# EAGLE design sb7pads-7D (EAGLE 9.4.2)
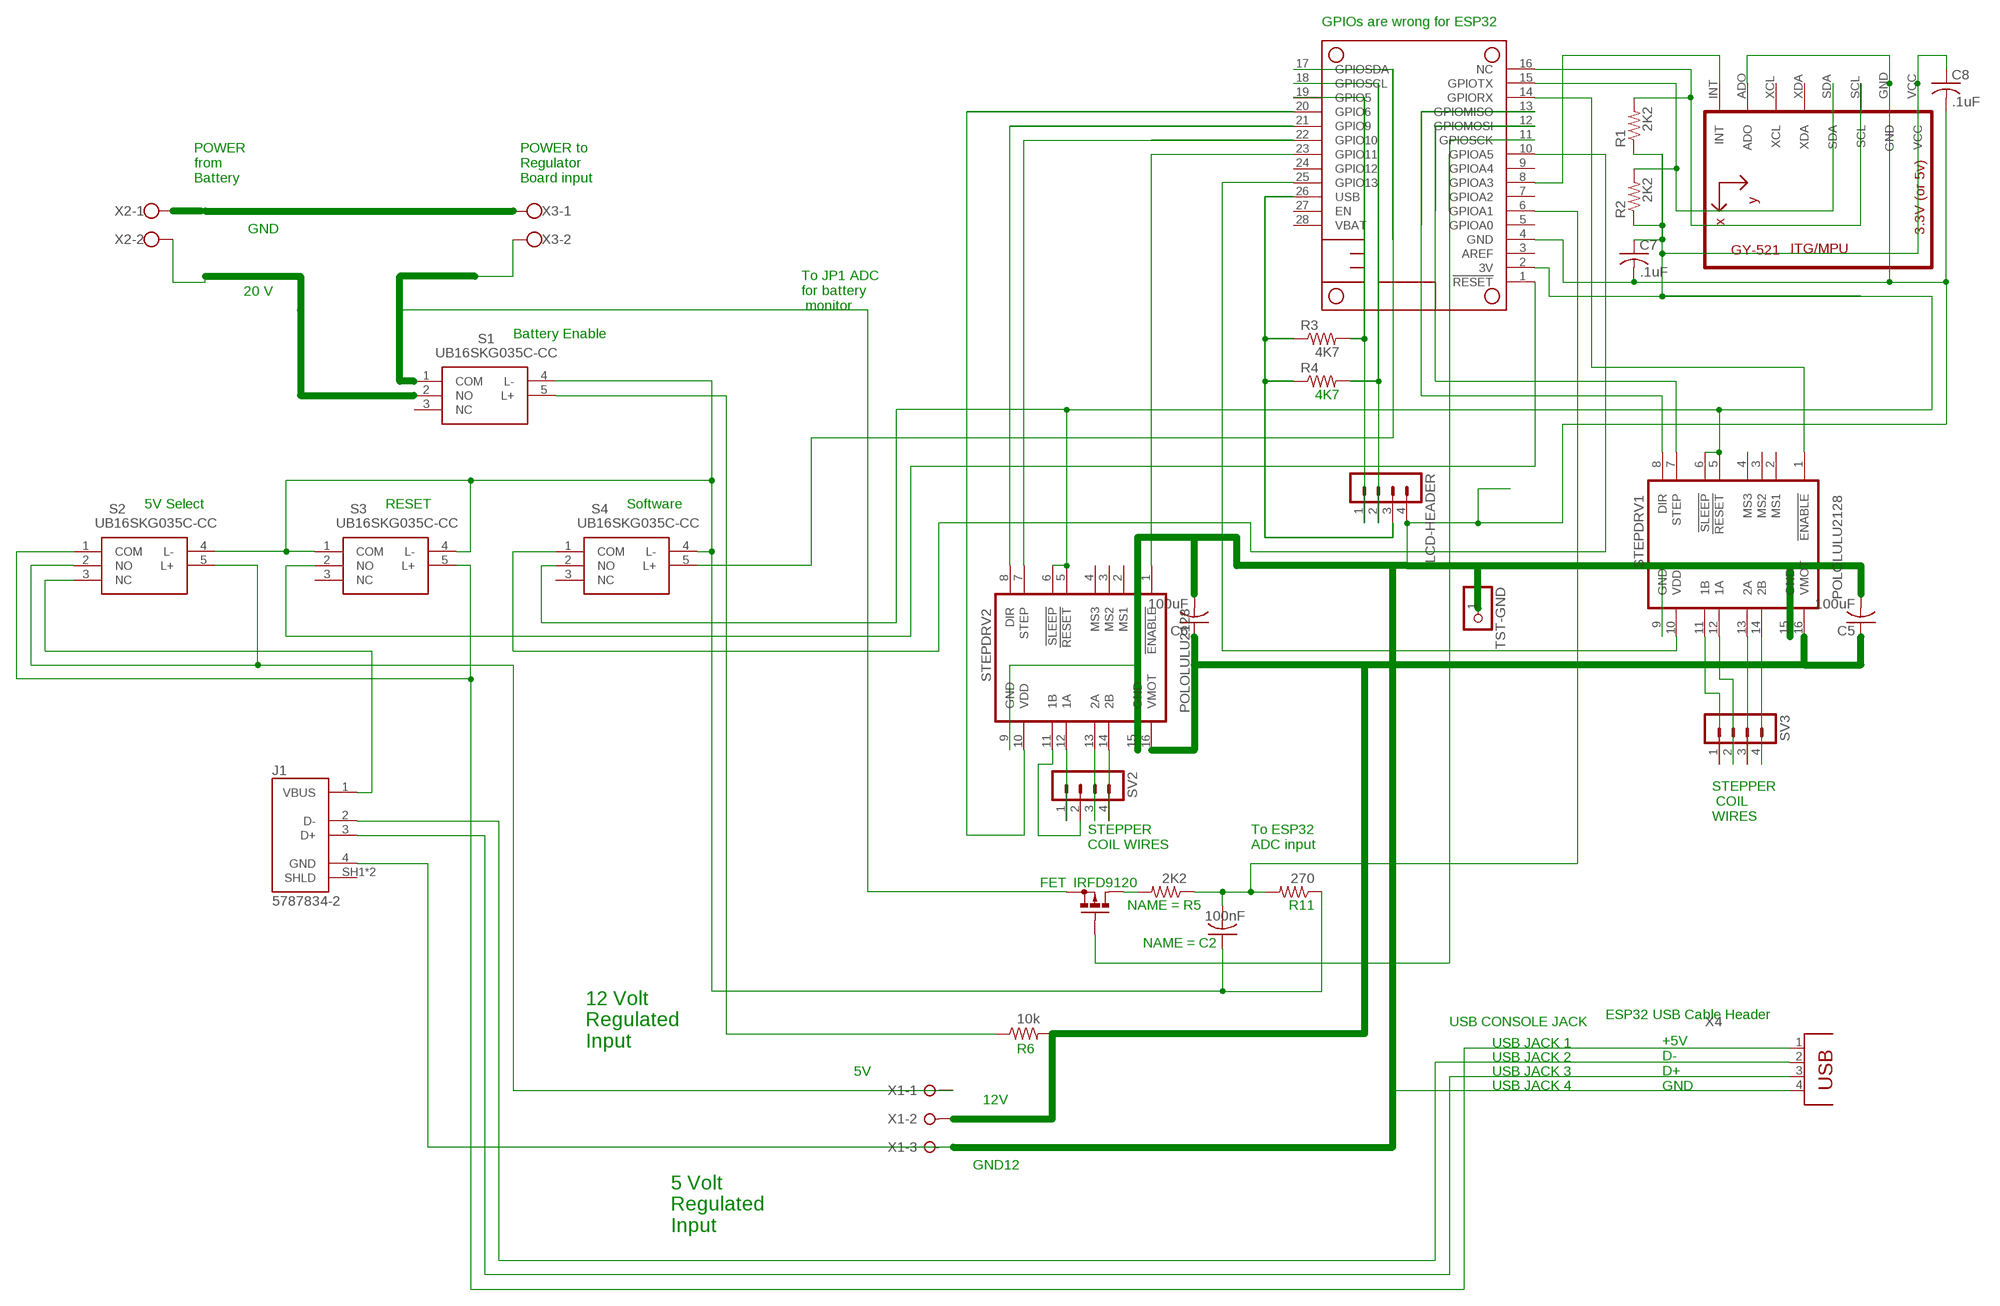
[diagram p0: schematic, sheet 1]

## Parts
C2  100nF  C-US050-025X075  [C050-025X075]
C5  100uF  C-US050-024X044  [C050-024X044]
C6  100uF  C-US050-024X044  [C050-024X044]
C7  .1uF  C-US050-024X044  [C050-024X044]
C8  .1uF  C-US050-024X044  [C050-024X044]
FET  IRFD9120  [C370-01]
J1  5787834-2  [TE_5787834-2]
LCD-HEADER  MA04-1  [MA04-1]
MS2  FEATHERWING_NOHOLES  [FEATHERWING_NOHOLES]
R1  2K2  R-US_0309/12  [0309/12]
R2  2K2  R-US_0309/12  [0309/12]
R3  4K7  R-US_0309/12  [0309/12]
R4  4K7  R-US_0309/12  [0309/12]
R5  2K2  R-US_0207/10  [0207/10]
R6  10k  R-US_0207/10  [0207/10]
R11  270  R-US_0207/10  [0207/10]
S1  UB16SKG035C-CC  [UB16SKG035CCC]
S2  UB16SKG035C-CC  [UB16SKG035CCC]
S3  UB16SKG035C-CC  [UB16SKG035CCC]
S4  UB16SKG035C-CC  [UB16SKG035CCC]
STEPDRV1  POLOLULU2128  [POLOLULU2128]
STEPDRV2  POLOLULU2128  [POLOLULU2128]
SV2  MA04-1  [MA04-1]
SV3  MA04-1  [MA04-1]
TST-GND  PINHD-1X1  [1X01]
U1  GY-521MPU6050  [GY-521]
X1  W237-3E  [W237-3E]
X2  W237-02P  [W237-132]
X3  W237-02P  [W237-132]
X4  PN87520  [PN87520]

## Nets
3V: C7.1 C8.1 MS2.2(3V) R1.1 R2.1 S4.2(NO) STEPDRV1.5(!RESET) STEPDRV1.6(!SLEEP) STEPDRV2.5(!RESET) STEPDRV2.6(!SLEEP) U1.VCC
N$1: MS2.25(GPIO13) STEPDRV1.10(VDD)
N$2: FET.G MS2.11(GPIOSCK)
N$3: S1.2(NO) X2.2
N$4: MS2.1(!RESET) S3.2(NO)
N$5: MS2.21(GPIO9) STEPDRV2.8(DIR)
N$6: FET.S S1.1(COM) X3.2
N$7: MS2.14(GPIORX) STEPDRV1.1(!ENABLE)
N$8: STEPDRV2.14(2B) SV2.4
N$9: STEPDRV2.12(1A) SV2.1
N$11: LCD-HEADER.1 MS2.19(GPIO5) R3.2
N$12: STEPDRV2.13(2A) SV2.3
N$13: STEPDRV2.11(1B) SV2.2
N$14: MS2.8(GPIOA3) U1.INT
N$15: MS2.12(GPIOMOSI) STEPDRV1.7(STEP)
N$16: STEPDRV1.14(2B) SV3.4
N$17: MS2.16(NC) R1.2 U1.SCL
N$18: STEPDRV1.13(2A) SV3.3
N$19: STEPDRV1.12(1A) SV3.2
N$20: STEPDRV1.11(1B) SV3.1
N$21: X2.1 X3.1
N$22: J1.2(D-) X4.2
N$23: J1.3(D+) X4.3
N$24: MS2.13(GPIOMISO) STEPDRV1.8(DIR)
N$25: MS2.15(GPIOTX) R2.2 U1.SDA
N$27: C5.2 C6.2 C7.2 C8.2 J1.4(GND) LCD-HEADER.4 MS2.4(GND) STEPDRV1.9(GND) STEPDRV1.15(GND) STEPDRV2.9(GND) STEPDRV2.15(GND) TST-GND.1 U1.ADO U1.GND X1.3 X4.4
N$28: S2.2(NO) S2.5(L+) X1.1
N$29: MS2.17(GPIOSDA) S4.5(L+)
N$30: C2.2 MS2.6(GPIOA1) R5.1 R11.2
N$31: R6.1 S1.5(L+)
N$33: S2.1(COM) S3.5(L+) X4.1
N$34: MS2.22(GPIO10) STEPDRV2.7(STEP)
N$35: LCD-HEADER.2 MS2.18(GPIOSCL) R4.2
N$36: MS2.20(GPIO6) STEPDRV2.10(VDD)
N$37: MS2.23(GPIO11) STEPDRV2.1(!ENABLE)
N$44: MS2.10(GPIOA5) S4.1(COM)
N$45: C5.1 C6.1 R6.2 STEPDRV1.16(VMOT) STEPDRV2.16(VMOT) X1.2
N$50: J1.1(VBUS) S2.3(NC)
N$51: FET.D FET.D1(D) R5.2
N$56: C2.1 R11.1 S1.4(L-) S2.4(L-) S3.1(COM) S3.4(L-) S4.4(L-)
USB: LCD-HEADER.3 MS2.26(USB) R3.1 R4.1
Unconnected: J1.SH1(SHLD) J1.SH2(SHLD) MS2.3(AREF) MS2.5(GPIOA0) MS2.7(GPIOA2) MS2.9(GPIOA4) MS2.24(GPIO12) MS2.27(EN) MS2.28(VBAT) S1.3(NC) S3.3(NC) S4.3(NC) STEPDRV1.2(MS1) STEPDRV1.3(MS2) STEPDRV1.4(MS3) STEPDRV2.2(MS1) STEPDRV2.3(MS2) STEPDRV2.4(MS3) U1.XCL U1.XDA

## Notes on the sheet
- GPIOs are wrong for ESP32
- POWER
  from
  Battery
- POWER to
  Regulator
  Board input
- GND
- 20 V
- To JP1 ADC
  for battery
   monitor
- Battery Enable
- 5V Select | RESET | Software
- STEPPER
   COIL
  WIRES
- STEPPER
  COIL WIRES
- To ESP32
  ADC input
- ESP32 USB Cable Header
- USB CONSOLE JACK
- 12 Volt
  Regulated
  Input
- USB JACK 1
- USB JACK 2
- 5V | USB JACK 3
- USB JACK 4
- +5V
  D-
  D+
  GND
- 12V
- GND12
- 5 Volt
  Regulated
  Input

## Library data of the parts
C2 C5-C8 = rcl:C-US: CAPACITOR, American symbol; SPICEPREFIX: C
FET = transistor-small-signal:IRFD9120: P-CHANNEL MOS FET
J1 = 5787834-2:5787834-2: Conn USB 2.0 Type B RCP 4 POS 2.5mm Solder ST Thru-Hole 4 Terminal 1 Port Box/Tray; COMMENT: 5787834-2; DESCRIPTION: Conn USB 2.0 Type B RCP 4 POS 2.5mm Solder ST Thru-Hole 4 Terminal 1 Port Box/Tray; DIGI-KEY_PART_NUMBER: A121598-ND; DIGI-KEY_PURCHASE_URL: https://www.digikey.com/product-detail/en/te-connectivity-amp-connectors/5787834-2/A121598-ND/2286710?utm_source=snapeda&utm_medium=aggregator&utm_campaign=symbol; EU_ROHS_COMPLIANCE: Compliant; MF: TE Connectivity; MP: 5787834-2; PACKAGE: None; TE_PURCHASE_URL: https://www.te.com/usa-en/product-5787834-2.html?te_bu=Cor&te_type=disp&te_campaign=seda_glo_cor-seda-global-disp-prtnr-fy19-seda-model-bom-cta_sma-317_1&elqCampaignId=32493
LCD-HEADER SV2 SV3 = con-lstb:MA04-1: PIN HEADER; OC_FARNELL: unknown; OC_NEWARK: unknown
MS2 = microbuilder:FEATHERWING
R1-R4 = resistor:R-US_: RESISTOR, American symbol
R5 R6 R11 = rcl:R-US_: RESISTOR, American symbol; SPICEPREFIX: R
S1-S4 = UB16SKG035C-CC:UB16SKG035C-CC: Pushbutton Switches ON-ON SQ .4VA RED LED & CAP PC TERM Source: Datasheet <https://www.mouser.com/datasheet/2/295/UBIlluminated-33436.pdf>; ALLIED_NUMBER: 71044456; ALLIED_PRICE-STOCK: https://www.alliedelec.com/nkkswitches-ub16skg035c-cc/71044456/; DESCRIPTION: Pushbutton Switches ON-ON SQ .4VA RED LED & CAP PC TERM; HEIGHT: 13.5mm; MANUFACTURER_NAME: NKK Switches; MANUFACTURER_PART_NUMBER: UB16SKG035C-CC; MOUSER_PART_NUMBER: 633-UB16SKG035CCC; MOUSER_PRICE-STOCK: https://www.mouser.com/Search/Refine.aspx?Keyword=633-UB16SKG035CCC
STEPDRV1 STEPDRV2 = stepper_drivers_etc:POLOLULU2128
TST-GND = pinhead:PINHD-1X1: PIN HEADER
U1 = gy-521a:GY-521
X1 = con-wago-508:W237-3E: WAGO SREW CLAMP; OC_FARNELL: unknown; OC_NEWARK: unknown
X2 X3 = con-wago-508:W237-02P: WAGO SREW CLAMP
X4 = con-berg:PN87520: BERG USB connector; OC_FARNELL: unknown; OC_NEWARK: unknown

## Board
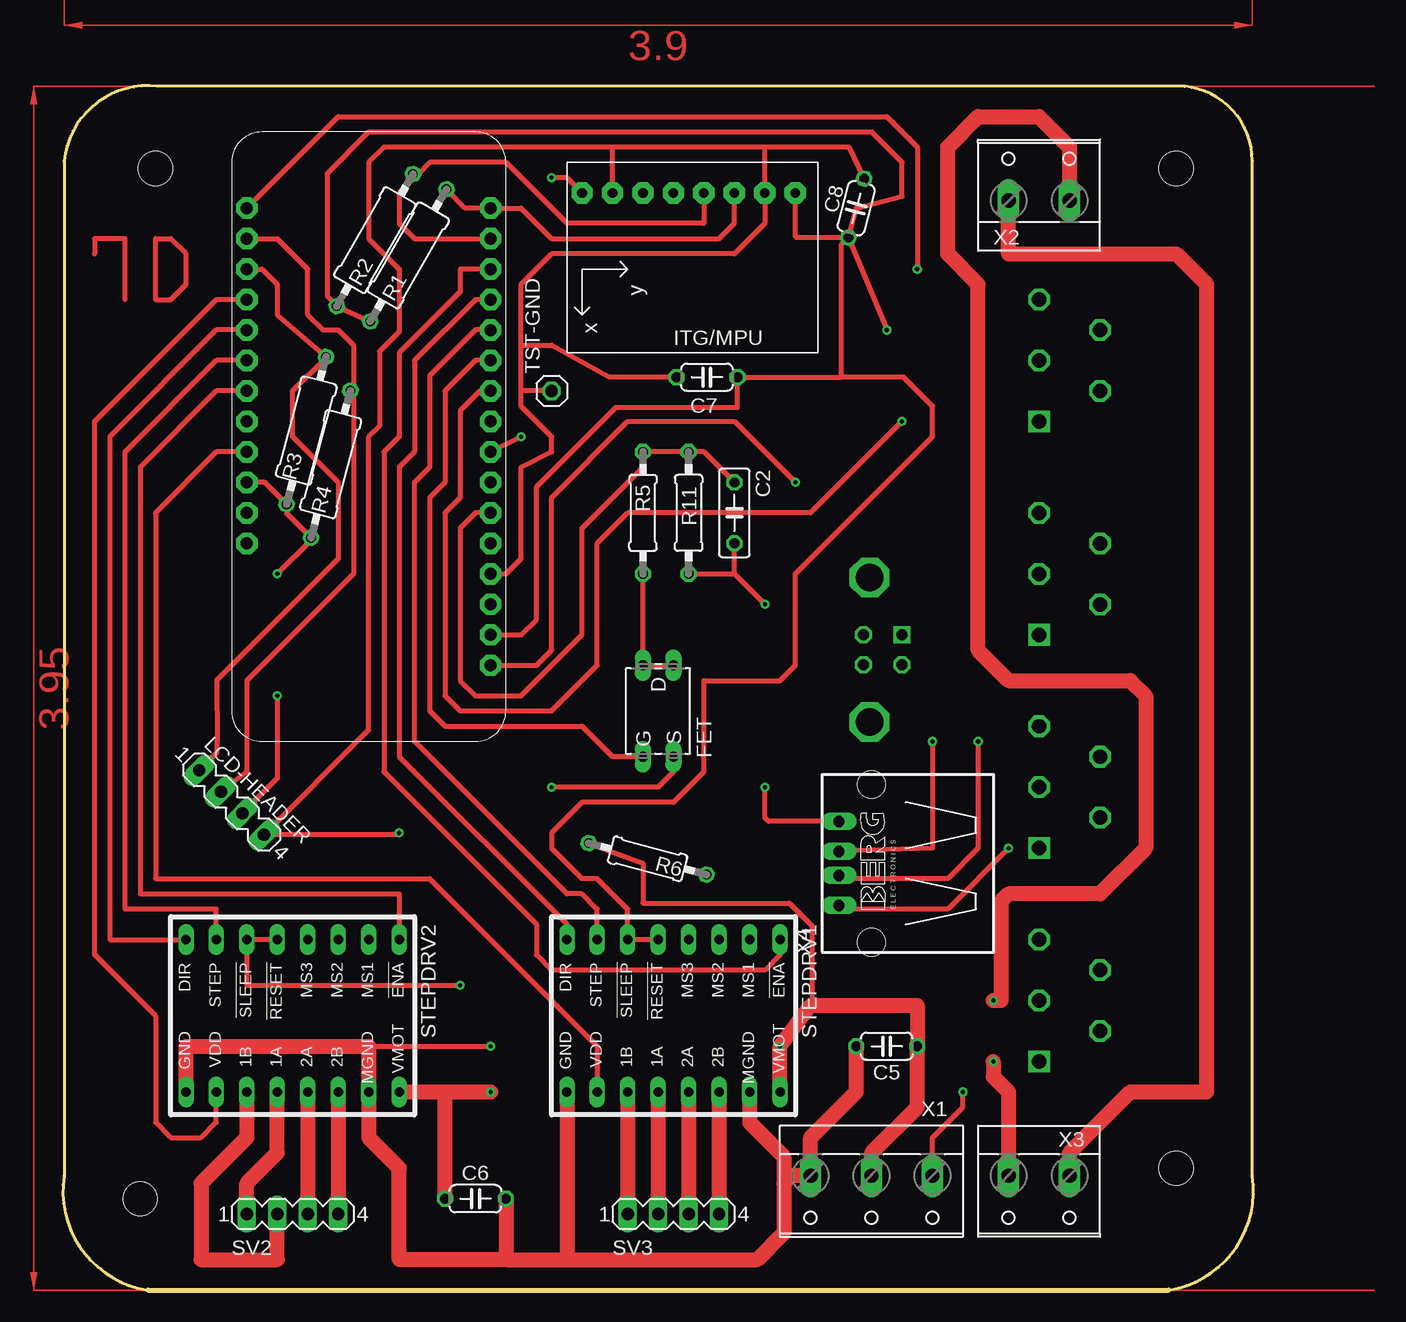
[diagram p1: board, top side]
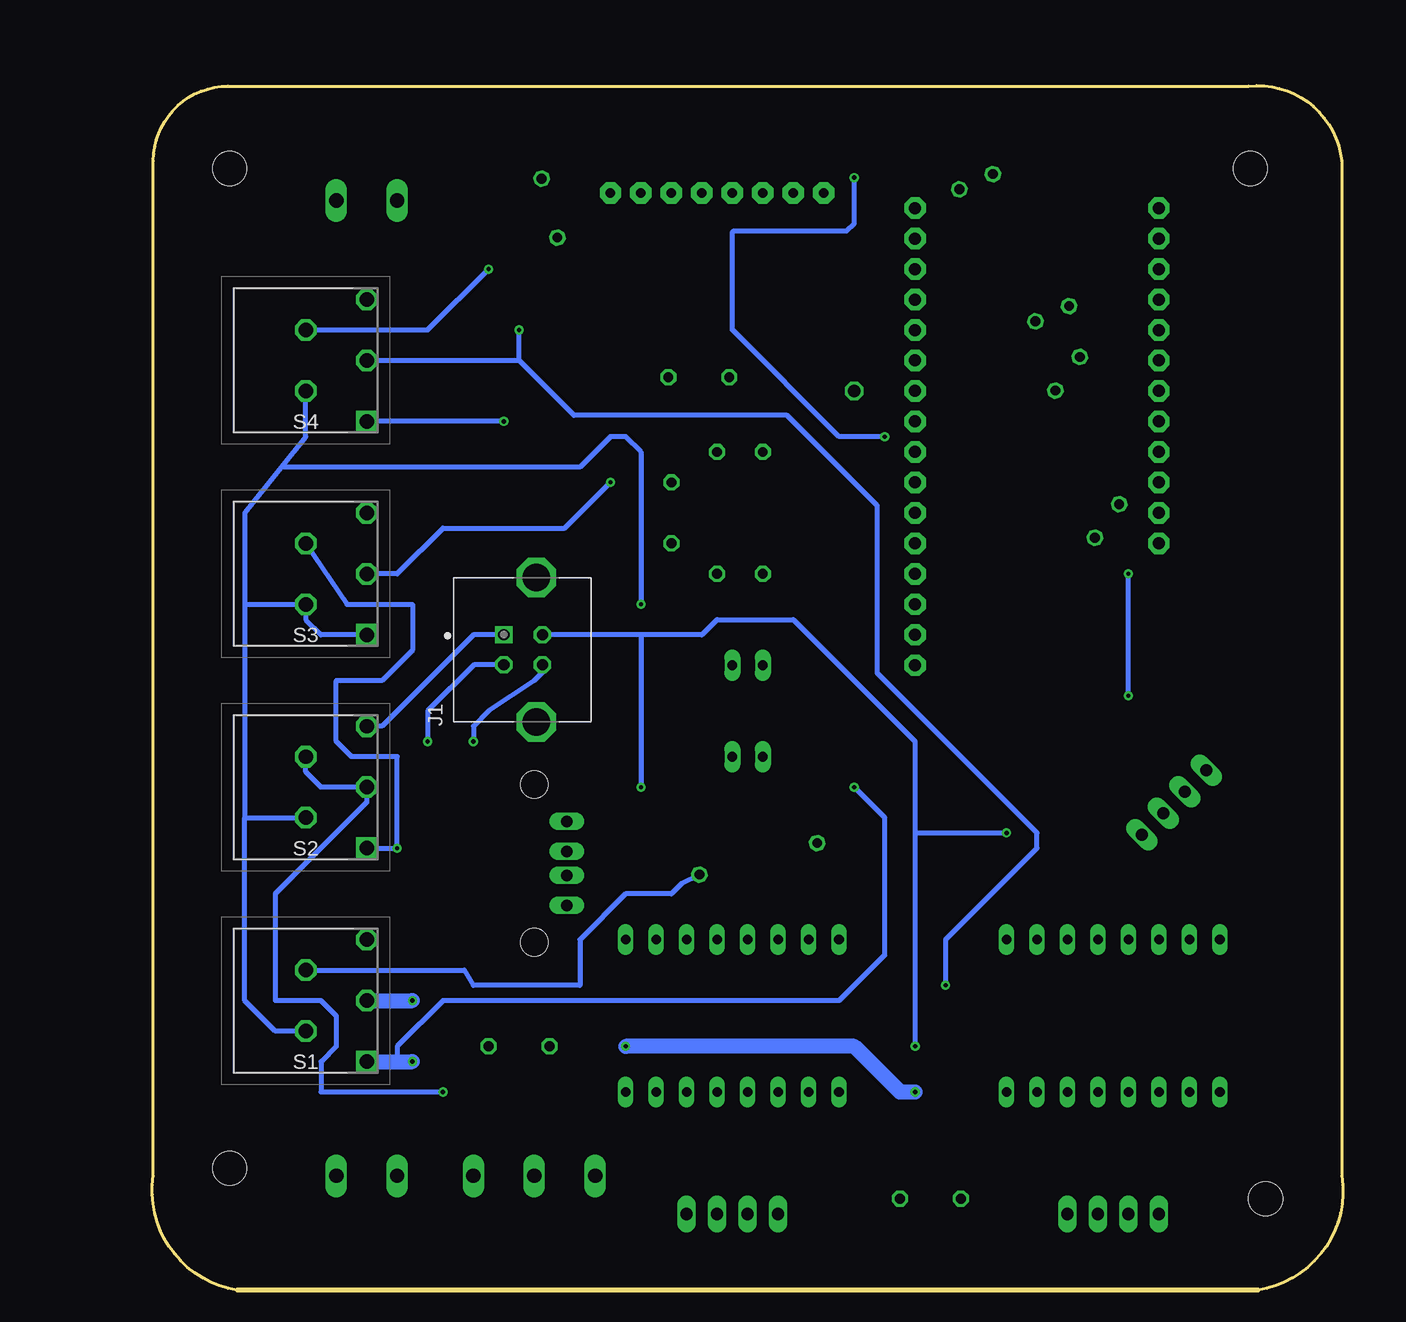
[diagram p2: board, bottom side, seen from below]

Size 99.25 x 100.37 mm. Coordinates in mm from the lower left corner, seen from the top.
Outline: 99.15,94.11 arc90 92.93,100.33 7.84,100.33 arc90 0.09,94.11 0.09,9.53 arc90 7.08,0 92.17,0 arc90 99.15,9.53 99.15,94.11
Copper layers (1*16): Top 0.035mm / dielectric 1.5mm / Bottom 0.035mm
Design rules "default": minimum track width 6mil, minimum drill 0.35mm, track to track 6mil, track to pad 6mil, pad to pad 6mil, via to via 6mil, smd to smd 6mil, copper to edge 40mil, drill to drill 6mil, minimum pad ring 10mil, minimum via ring 8mil, stop-mask expansion 4mil, vias tented up to drill 0mil, thermal gap 10mil
Holes 2.85 mm at 92.8,93.47 6.44,7.62 7.71,93.47 92.8,10.16

### Footprints (pad centres in the part's own frame; a part is rotated, then mirrored left to right if it is on the bottom)
C050-025X075 = drill 0.813 octagon: 1 -2.54,0; 2 2.54,0
C050-024X044 = drill 0.813 octagon: 1 -2.54,0; 2 2.54,0
C370-01 = drill 0.813 long: D -3.81,1.27; D1 -3.81,-1.27; G 3.81,-1.27; S 3.81,1.27
TE_5787834-2 = drill 0.92 square: 1 0,0 | drill 0.92 octagon: 2 -2.5,0; 3 -2.5,-3.21; 4 0,-3.21 | drill 2.3 octagon: SH1 -7.27,-2.705; SH2 4.77,-2.705
MA04-1 = drill 1.016 long: 1 -3.81,0; 2 -1.27,0; 3 1.27,0; 4 3.81,0
FEATHERWING_NOHOLES = drill 1 pad 1.778 octagon: 1 6.35,1.27; 2 8.89,1.27; 3 11.43,1.27; 4 13.97,1.27; 5 16.51,1.27; 6 19.05,1.27; 7 21.59,1.27; 8 24.13,1.27; 9 26.67,1.27; 10 29.21,1.27; 11 31.75,1.27; 12 34.29,1.27; 13 36.83,1.27; 14 39.37,1.27; 15 41.91,1.27; 16 44.45,1.27; 17 44.45,21.59; 18 41.91,21.59; 19 39.37,21.59; 20 36.83,21.59; 21 34.29,21.59; 22 31.75,21.59; 23 29.21,21.59; 24 26.67,21.59; 25 24.13,21.59; 26 21.59,21.59; 27 19.05,21.59; 28 16.51,21.59
0309/12 = drill 0.813 octagon: 1 -6.35,0; 2 6.35,0
0207/10 = drill 0.813 octagon: 1 -5.08,0; 2 5.08,0
UB16SKG035CCC = drill 1.2 pad 1.8 square: 1 0,0 | drill 1.2 pad 1.8 octagon: 2 0,5.08; 3 0,10.16; 4 -5.08,2.54; 5 -5.08,7.62
POLOLULU2128 = drill 0.8 long: 1 -7.62,7.62; 2 -7.62,5.08; 3 -7.62,2.54; 4 -7.62,0; 5 -7.62,-2.54; 6 -7.62,-5.08; 7 -7.62,-7.62; 8 -7.62,-10.16; 9 5.08,-10.16; 10 5.08,-7.62; 11 5.08,-5.08; 12 5.08,-2.54; 13 5.08,0; 14 5.08,2.54; 15 5.08,5.08; 16 5.08,7.62
1X01 = drill 1.016 octagon: 1 0,0
GY-521 = drill 0.8 pad 1.778 octagon: ADO -8.89,-6.35; GND -8.89,6.35; INT -8.89,-8.89; SCL -8.89,3.81; SDA -8.89,1.27; VCC -8.89,8.89; XCL -8.89,-3.81; XDA -8.89,-1.27
W237-3E = drill 1.194 long: 1 -5.08,-0.635; 2 0,-0.635; 3 5.08,-0.635
W237-132 = drill 1.194 long: 1 -2.54,-0.635; 2 2.54,-0.635
PN87520 = drill 0.95 long: 1 -3.5,2.71; 2 -1,2.71; 3 1,2.71; 4 3.5,2.71 | hole 2.3: -6.57,0; 6.57,0

### Placement (x,y rotation side)
C2  55.97,64.77 90 top
C5  68.67,20.32 180 top
C6  34.38,7.62 0 top
C7  53.69,76.07 180 top
C8  66.13,90.17 75 top
FET  49.62,48.26 270 top
J1  69.94,54.61 90 bottom
LCD-HEADER  14.06,40.64 315 top
MS2  36.92,45.72 90 top
R1  28.79,86.23 60 top
R2  26,87.5 60 top
R3  20.29,71.63 75 top
R4  22.32,68.83 75 top
R5  48.35,64.77 270 top
R6  48.73,35.94 165 top
R11  52.16,64.77 90 top
S1  81.37,19.05 0 bottom
S2  81.37,36.83 0 bottom
S3  81.37,54.61 0 bottom
S4  81.37,72.39 0 bottom
STEPDRV1  52.16,21.59 270 top
STEPDRV2  20.41,21.59 270 top
SV2  19.14,6.35 0 top
SV3  50.89,6.35 0 top
TST-GND  40.73,74.93 0 top
U1  52.16,82.55 270 top
X1  67.4,8.89 180 top
X2  81.37,91.44 0 top
X3  81.37,8.89 180 top
X4  67.4,35.56 90 top

### Tracks (layer width: path | path; a pad name or v marks a point on that pad's centre or on a via)
3V  (via drill 0.35)
  Top 0.406: MS2.2 38.19,54.61 39.46,55.88 39.46,66.93 46.07,73.53 56.23,73.53 C7.1 64.86,76.07 | STEPDRV1.5 STEPDRV1.6 47.08,31.75 44.54,34.29 43.27,34.29 40.73,36.83 40.73,38.1 43.27,40.64 50.89,40.64 53.43,43.18 53.43,50.8 59.78,50.8 61.05,52.07 61.05,59.69 72.48,71.12 72.48,73.66 70.07,76.07 64.86,76.07 | STEPDRV2.5 STEPDRV2.6 15.33,25.4 v33.11,25.4 | R1.1 R2.1 22.83,82.04 22.06,82.8 22.06,93.09 25.49,96.52 67.4,96.52 69.94,93.98 69.94,91.14 66.13,90.17 C8.1 | U1.VCC 61.05,87.8 61.14,87.72 C8.1 | C8.1 v68.67,80.01 | C8.1 64.86,87.1 64.86,76.07
  Bottom 0.406: v33.11,25.4 33.11,29.21 25.49,36.83 25.49,38.1 38.83,51.44 38.83,65.41 46.32,72.9 64.1,72.9 68.67,77.47 | S4.2 68.67,77.47 | 68.67,77.47 v68.67,80.01
N$1
  Top 0.406: STEPDRV1.10 44.54,20.32 30.57,34.29 7.71,34.29 7.71,64.77 12.79,69.85 MS2.25
N$2
  Top 0.406: MS2.11 34.38,77.47 31.84,74.93 31.84,67.31 30.57,66.04 30.57,48.26 31.84,46.99 43.27,46.99 45.81,44.45 FET.G
N$3  (via drill 0.35)
  Top 1.27: v77.56,24.13 78.2,24.13 78.2,32.38 78.83,33.02 86.45,33.02 90.26,36.83 90.26,49.53 88.99,50.8 78.83,50.8 76.29,53.34 76.29,83.82 73.75,86.36 73.75,95.25 76.29,97.79 81.37,97.79 83.91,95.25 X2.2
  Bottom 1.27: S1.2 v77.56,24.13
N$4  (via drill 0.35)
  Top 0.406: MS2.1 39.46,52.07 40.73,53.34 40.73,66.04 47.08,72.39 55.97,72.39 v61.05,67.31
  Bottom 0.406: S3.2 78.83,59.69 75.02,63.5 64.86,63.5 v61.05,67.31
N$5
  Top 0.406: MS2.21 12.79,80.01 3.9,71.12 3.9,29.21 STEPDRV2.8
N$6  (via drill 0.35)
  Top 0.406: v40.73,41.91 49.62,41.91 50.89,43.18 FET.S
  Top 1.27: v77.56,19.05 77.56,17.78 78.83,16.51 X3.2
  Bottom 0.406: v40.73,41.91 38.19,39.37 38.19,27.94 42,24.13 75.02,24.13 78.83,20.32 78.83,19.05
  Bottom 1.27: S1.1 78.83,19.05 v77.56,19.05
N$7
  Top 0.406: MS2.14 33.11,85.09 33.11,83.19 28.03,78.11 28.03,71.12 26.76,69.85 26.76,43.18 39.46,30.48 39.46,27.94 40.73,26.67 58.51,26.67 59.78,27.94 STEPDRV1.1
N$8
  Top 1.27: STEPDRV2.14 SV2.4
N$9
  Top 1.27: SV2.1 15.33,8.89 17.87,11.43 STEPDRV2.12
N$10
  Top 0.406: 5.17,82.55 5.17,87.63 2.63,87.63 2.63,86.36
N$11
  Top 0.406: MS2.19 16.6,85.09 17.87,83.82 17.87,81.27 R3.2 21.93,77.72 19.14,74.93 19.14,71.12 22.95,67.31 22.95,60.96 12.83,50.83 12.85,45.72 12.85,44.82 LCD-HEADER.1
N$12
  Top 1.27: STEPDRV2.13 SV2.3
N$13
  Top 1.27: STEPDRV2.11 15.33,12.7 11.52,8.89 11.52,2.54 17.87,2.54 SV2.2
N$14  (via drill 0.35)
  Top 0.406: MS2.8 v38.19,71.12 | U1.INT 42,92.71 v40.73,92.71
  Bottom 0.406: v38.19,71.12 42,71.12 50.89,80.01 50.89,88.14 50.77,88.27 41.37,88.27 40.73,88.9 v40.73,92.71
N$15
  Top 0.406: MS2.12 34.38,80.01 30.57,76.2 30.57,68.58 29.3,67.31 29.3,45.72 42,33.02 43.27,33.02 44.54,31.75 STEPDRV1.7
N$16
  Top 1.27: STEPDRV1.14 SV3.4
N$17
  Top 0.406: U1.SCL 55.97,88.9 54.7,87.63 40.73,87.63 38.19,90.17 MS2.16 33.53,90.17 R1.2
N$18
  Top 1.27: STEPDRV1.13 SV3.3
N$19
  Top 1.27: STEPDRV1.12 SV3.2
N$20
  Top 1.27: STEPDRV1.11 SV3.1
N$21
  Top 1.27: X2.1 78.83,86.36 92.8,86.36 95.34,83.82 95.34,16.51 88.99,16.51 83.91,11.43 X3.1
N$22  (via drill 0.35)
  Top 0.406: X4.2 64.96,34.29 73.75,34.29 76.29,36.83 v76.29,45.72
  Bottom 0.406: J1.2 72.44,52.11 76.29,48.26 v76.29,45.72
N$23  (via drill 0.35)
  Top 0.406: v72.48,45.72 72.48,36.83 X4.3
  Bottom 0.406: J1.3 66.73,51.47 67.4,50.8 71.21,48.26 72.48,46.99 v72.48,45.72
N$24
  Top 0.406: MS2.13 34.38,82.55 29.3,77.47 29.3,69.85 28.03,68.58 28.03,44.45 42,30.48 STEPDRV1.8
N$25
  Top 0.152: R2.2 29.18,92.58
  Top 0.406: MS2.15 29.3,87.63 28.03,88.9 28.03,91.44 29.18,92.58 | U1.SDA 53.43,88.9 42,88.9 36.92,93.98 30.57,93.98 29.59,93 R2.2
N$26
  Top 0.406: 10.25,86.36 8.98,87.63 7.71,87.63 7.71,82.55 8.98,82.55 10.25,83.82 10.25,86.36
N$27  (via drill 0.35)
  Top 0.406: 58.51,95.25 65.52,95.25 C8.2 | 58.51,95.25 45.81,95.25 | 45.81,95.25 26.76,95.25 25.49,93.98 25.49,87.63 28.03,85.09 28.03,79.88 26.38,78.23 26.38,72.01 25.49,71.12 25.49,46.68 LCD-HEADER.4 27.88,37.95 v28.03,38.1 | MS2.4 36.92,59.69 38.19,60.96 38.19,68.58 40.73,69.85 40.73,71.12 38.19,73.66 38.19,74.93 | 38.19,78.74 38.19,83.82 40.73,86.36 55.97,86.36 58.51,88.9 U1.GND 58.51,95.25 | U1.ADO 45.81,95.25 | 38.19,74.93 38.19,78.74 | C7.2 45.58,76.07 40.73,78.74 38.19,78.74 | TST-GND.1 38.19,74.93 | 25.49,20.32 v35.65,20.32 | X4.4 58.82,39.06 58.51,39.37 v58.51,41.91
  Top 1.27: 36.92,2.54 28.03,2.54 28.03,10.16 25.49,12.7 STEPDRV2.15 25.49,20.32 10.25,20.32 STEPDRV2.9 | 36.92,2.54 42,2.54 | STEPDRV1.9 42,2.54 | C5.2 66.13,16.51 62.32,12.7 X1.3 60.73,9.53 60.1,8.89 | C6.2 36.92,2.54 | STEPDRV1.15 57.24,13.97 60.1,11.11 60.1,8.89 | 42,2.54 57.88,2.54 60.1,4.76 60.1,8.89
  Bottom 0.406: 35.65,38.1 35.65,45.72 45.81,55.88 52.16,55.88 53.43,54.61 58.51,54.61 | 35.65,38.1 v35.65,20.32 | 58.51,54.61 J1.4 | 58.51,54.61 v58.51,41.91 | 35.65,38.1 v28.03,38.1
N$28  (via drill 0.35)
  Top 0.406: X1.1 72.48,12.7 75.02,15.24 v75.02,16.51
  Bottom 0.406: S2.5 86.45,43.18 85.18,41.91 S2.2 81.37,40.64 88.99,33.02 88.99,24.13 85.18,24.13 83.91,22.86 83.91,20.32 85.18,19.05 85.18,16.51 v75.02,16.51
N$29  (via drill 0.35)
  Top 0.406: MS2.17 22.95,97.79 68.67,97.79 71.21,95.25 v71.21,85.09
  Bottom 0.406: S4.5 77.56,80.01 76.29,80.01 v71.21,85.09
N$30
  Top 0.406: MS2.6 34.38,64.77 33.11,63.5 33.11,50.8 34.38,49.53 38.19,49.53 43.27,54.61 43.27,63.5 48.35,68.58 R5.1 R11.2 53.43,69.85 C2.2
N$31
  Bottom 0.406: S1.5 73.23,26.67 72.48,25.4 63.59,25.4 63.59,29.21 59.78,33.02 55.97,33.02 55.1,33.89 R6.1
N$33  (via drill 0.35)
  Top 0.406: X4.1 65,31.75 73.75,31.75 v78.83,36.83
  Bottom 0.406: S3.5 83.02,57.15 77.56,57.15 77.56,53.34 80.1,50.8 83.91,50.8 83.91,45.72 82.64,44.45 78.83,44.45 v78.83,36.83 S2.1
N$34
  Top 0.406: MS2.22 12.79,77.47 5.17,69.85 5.17,31.75 12.79,31.75 STEPDRV2.7
N$35
  Top 0.406: MS2.18 17.87,87.63 20.41,85.09 20.41,81.28 21.68,80.01 22.95,80.01 24.22,78.74 24.22,74.93 | 24.22,74.93 24.18,74.97 R4.2 | 24.22,74.93 24.22,59.69 15.33,50.8 15.33,43.18 LCD-HEADER.2
N$36
  Top 0.406: MS2.20 12.79,82.55 2.63,72.39 2.63,27.94 7.71,22.86 7.71,13.97 8.98,12.7 11.52,12.7 12.79,13.97 STEPDRV2.10
N$37
  Top 0.406: MS2.23 12.79,74.93 6.44,68.58 6.44,33.02 28.03,33.02 STEPDRV2.1
N$44  (via drill 0.35)
  Top 0.406: MS2.10 34.76,74.93 33.11,73.28 33.11,66.04 31.84,64.77 31.84,49.53 33.11,48.26 40.73,48.26 44.54,52.07 44.54,62.23 47.08,64.77 62.32,64.77 v69.94,72.39
  Bottom 0.406: v69.94,72.39 S4.1
N$45  (via drill 0.35)
  Top 0.406: R6.2 48.35,35.56 48.35,32.26 60.54,32.26 62.45,30.35 62.45,23.85 62.32,23.72
  Top 1.27: STEPDRV2.16 31.84,16.51 | C6.1 31.84,16.51 | 31.84,16.51 v35.65,16.51 | X1.2 67.4,11.43 71.21,15.24 C5.1 71.21,23.72 62.32,23.72 v59.78,20.32 STEPDRV1.16
  Bottom 1.27: v59.78,20.32 40.73,20.32 36.92,16.51 v35.65,16.51
N$50
  Bottom 0.406: J1.1 72.48,54.61 80.1,46.99 S2.3
N$51
  Top 0.406: FET.D FET.D1 R5.2
N$56  (via drill 0.35)
  Top 0.406: R11.1 55.97,59.69 | v58.51,57.15 55.97,59.69 | 55.97,59.69 C2.1
  Bottom 0.406: 91.53,57.15 91.53,64.77 88.48,68.58 | 91.53,57.15 S3.4 86.45,55.88 85.18,54.61 S3.1 | 91.53,57.15 91.53,39.37 | 91.53,39.37 S2.4 | S1.4 88.99,21.59 91.53,24.13 91.53,39.37 | 88.48,68.58 63.59,68.58 61.05,71.12 59.78,71.12 58.51,69.85 v58.51,57.15 | 88.48,68.58 86.45,71.12 S4.4
USB  (via drill 0.35)
  Top 0.406: MS2.26 16.83,67.31 R3.1 18.64,64.73 R4.1 20.67,62.49 v17.87,59.69 | LCD-HEADER.3 17.87,42.65 v17.87,49.53
  Bottom 0.406: v17.87,49.53 v17.87,59.69
(copper drawn outside any net)
  shapes: Top area x2